# EasyEDA schematic SCH_Calculator YSWS_2026-07-11.json
TITLE: Sheet_1; REV: 1.0; Date: 2026-06-30; Sheet: 1/1; Drawn By: esemv; Company: Your Company
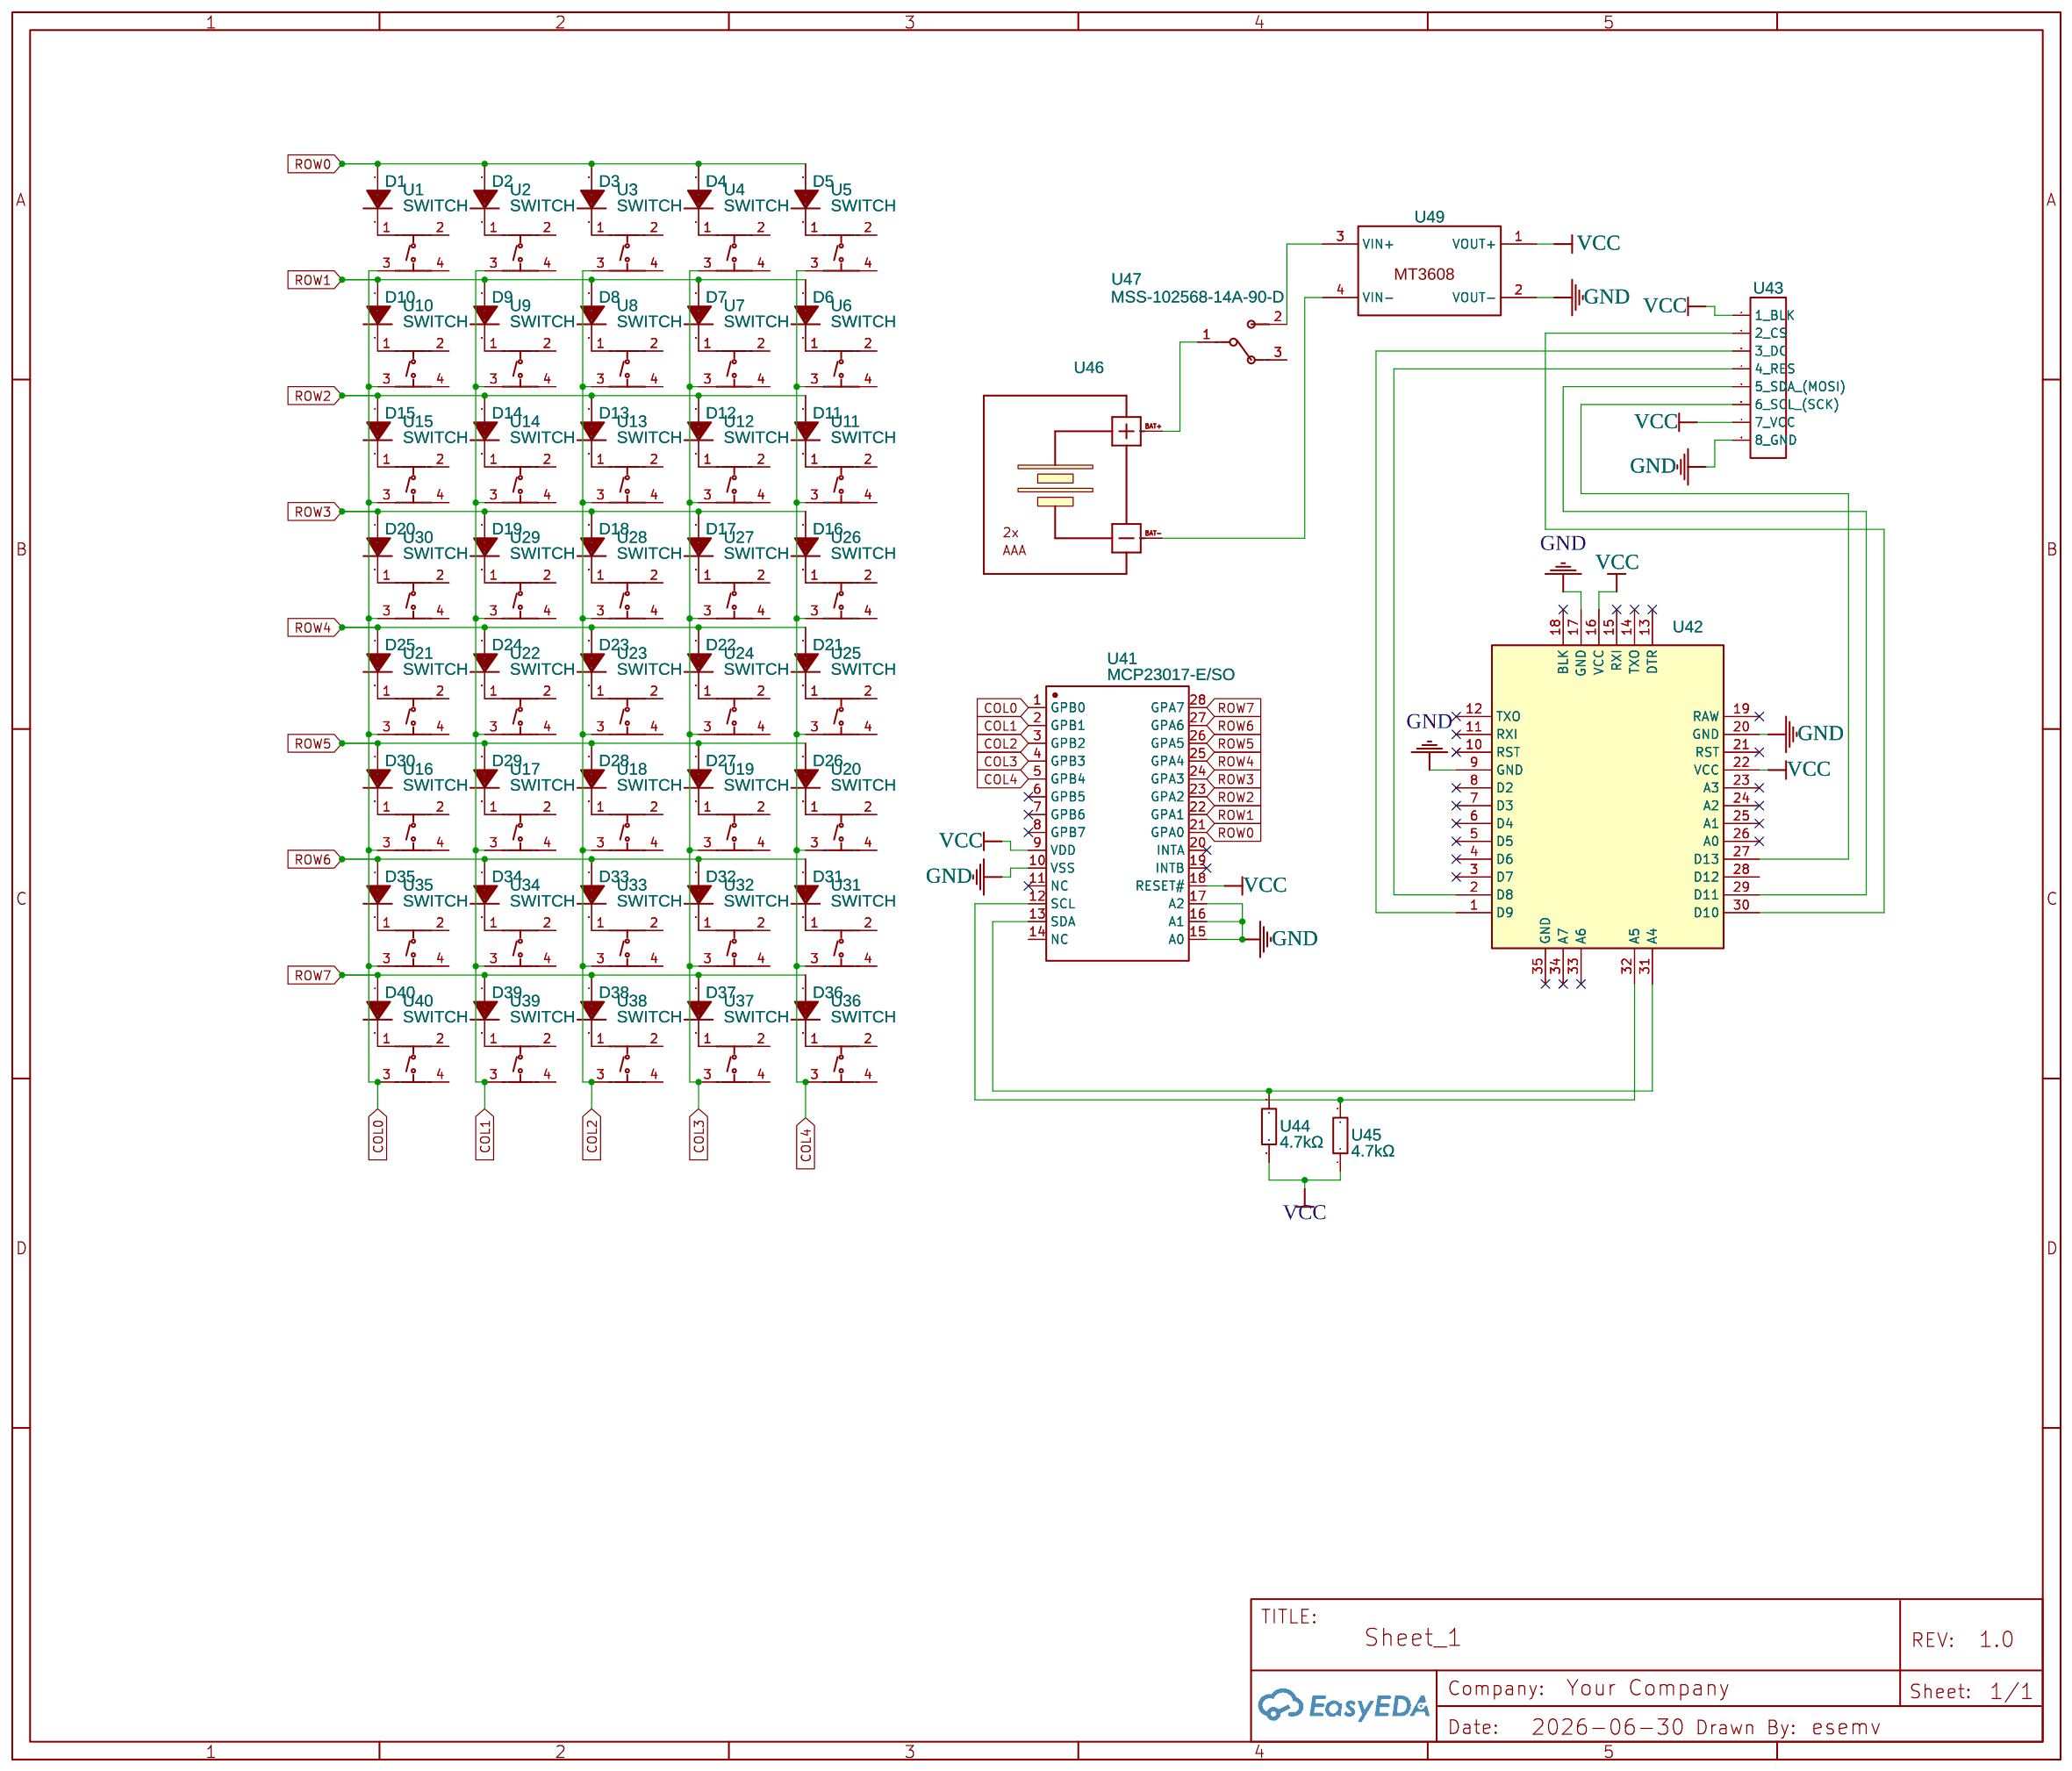
[diagram p0: schematic sheet]

## Parts
D1  1N4148  [DO-35_BD2.0-L4.0-P8.00-D0.5-FD]
D2  1N4148  [DO-35_BD2.0-L4.0-P8.00-D0.5-FD]
D3  1N4148  [DO-35_BD2.0-L4.0-P8.00-D0.5-FD]
D4  1N4148  [DO-35_BD2.0-L4.0-P8.00-D0.5-FD]
D5  1N4148  [DO-35_BD2.0-L4.0-P8.00-D0.5-FD]
D6  1N4148  [DO-35_BD2.0-L4.0-P8.00-D0.5-FD]
D7  1N4148  [DO-35_BD2.0-L4.0-P8.00-D0.5-FD]
D8  1N4148  [DO-35_BD2.0-L4.0-P8.00-D0.5-FD]
D9  1N4148  [DO-35_BD2.0-L4.0-P8.00-D0.5-FD]
D10  1N4148  [DO-35_BD2.0-L4.0-P8.00-D0.5-FD]
D11  1N4148  [DO-35_BD2.0-L4.0-P8.00-D0.5-FD]
D12  1N4148  [DO-35_BD2.0-L4.0-P8.00-D0.5-FD]
D13  1N4148  [DO-35_BD2.0-L4.0-P8.00-D0.5-FD]
D14  1N4148  [DO-35_BD2.0-L4.0-P8.00-D0.5-FD]
D15  1N4148  [DO-35_BD2.0-L4.0-P8.00-D0.5-FD]
D16  1N4148  [DO-35_BD2.0-L4.0-P8.00-D0.5-FD]
D17  1N4148  [DO-35_BD2.0-L4.0-P8.00-D0.5-FD]
D18  1N4148  [DO-35_BD2.0-L4.0-P8.00-D0.5-FD]
D19  1N4148  [DO-35_BD2.0-L4.0-P8.00-D0.5-FD]
D20  1N4148  [DO-35_BD2.0-L4.0-P8.00-D0.5-FD]
D21  1N4148  [DO-35_BD2.0-L4.0-P8.00-D0.5-FD]
D22  1N4148  [DO-35_BD2.0-L4.0-P8.00-D0.5-FD]
D23  1N4148  [DO-35_BD2.0-L4.0-P8.00-D0.5-FD]
D24  1N4148  [DO-35_BD2.0-L4.0-P8.00-D0.5-FD]
D25  1N4148  [DO-35_BD2.0-L4.0-P8.00-D0.5-FD]
D26  1N4148  [DO-35_BD2.0-L4.0-P8.00-D0.5-FD]
D27  1N4148  [DO-35_BD2.0-L4.0-P8.00-D0.5-FD]
D28  1N4148  [DO-35_BD2.0-L4.0-P8.00-D0.5-FD]
D29  1N4148  [DO-35_BD2.0-L4.0-P8.00-D0.5-FD]
D30  1N4148  [DO-35_BD2.0-L4.0-P8.00-D0.5-FD]
D31  1N4148  [DO-35_BD2.0-L4.0-P8.00-D0.5-FD]
D32  1N4148  [DO-35_BD2.0-L4.0-P8.00-D0.5-FD]
D33  1N4148  [DO-35_BD2.0-L4.0-P8.00-D0.5-FD]
D34  1N4148  [DO-35_BD2.0-L4.0-P8.00-D0.5-FD]
D35  1N4148  [DO-35_BD2.0-L4.0-P8.00-D0.5-FD]
D36  1N4148  [DO-35_BD2.0-L4.0-P8.00-D0.5-FD]
D37  1N4148  [DO-35_BD2.0-L4.0-P8.00-D0.5-FD]
D38  1N4148  [DO-35_BD2.0-L4.0-P8.00-D0.5-FD]
D39  1N4148  [DO-35_BD2.0-L4.0-P8.00-D0.5-FD]
D40  1N4148  [DO-35_BD2.0-L4.0-P8.00-D0.5-FD]
U1  SWITCH  [SW-TH_4P-L4.5-W4.5-P3.00-LS5.0-H5.5]
U2  SWITCH  [SW-TH_4P-L4.5-W4.5-P3.00-LS5.0-H5.5]
U3  SWITCH  [SW-TH_4P-L4.5-W4.5-P3.00-LS5.0-H5.5]
U4  SWITCH  [SW-TH_4P-L4.5-W4.5-P3.00-LS5.0-H5.5]
U5  SWITCH  [SW-TH_4P-L4.5-W4.5-P3.00-LS5.0-H5.5]
U6  SWITCH  [SW-TH_4P-L4.5-W4.5-P3.00-LS5.0-H5.5]
U7  SWITCH  [SW-TH_4P-L4.5-W4.5-P3.00-LS5.0-H5.5]
U8  SWITCH  [SW-TH_4P-L4.5-W4.5-P3.00-LS5.0-H5.5]
U9  SWITCH  [SW-TH_4P-L4.5-W4.5-P3.00-LS5.0-H5.5]
U10  SWITCH  [SW-TH_4P-L4.5-W4.5-P3.00-LS5.0-H5.5]
U11  SWITCH  [SW-TH_4P-L4.5-W4.5-P3.00-LS5.0-H5.5]
U12  SWITCH  [SW-TH_4P-L4.5-W4.5-P3.00-LS5.0-H5.5]
U13  SWITCH  [SW-TH_4P-L4.5-W4.5-P3.00-LS5.0-H5.5]
U14  SWITCH  [SW-TH_4P-L4.5-W4.5-P3.00-LS5.0-H5.5]
U15  SWITCH  [SW-TH_4P-L4.5-W4.5-P3.00-LS5.0-H5.5]
U16  SWITCH  [SW-TH_4P-L4.5-W4.5-P3.00-LS5.0-H5.5]
U17  SWITCH  [SW-TH_4P-L4.5-W4.5-P3.00-LS5.0-H5.5]
U18  SWITCH  [SW-TH_4P-L4.5-W4.5-P3.00-LS5.0-H5.5]
U19  SWITCH  [SW-TH_4P-L4.5-W4.5-P3.00-LS5.0-H5.5]
U20  SWITCH  [SW-TH_4P-L4.5-W4.5-P3.00-LS5.0-H5.5]
U21  SWITCH  [SW-TH_4P-L4.5-W4.5-P3.00-LS5.0-H5.5]
U22  SWITCH  [SW-TH_4P-L4.5-W4.5-P3.00-LS5.0-H5.5]
U23  SWITCH  [SW-TH_4P-L4.5-W4.5-P3.00-LS5.0-H5.5]
U24  SWITCH  [SW-TH_4P-L4.5-W4.5-P3.00-LS5.0-H5.5]
U25  SWITCH  [SW-TH_4P-L4.5-W4.5-P3.00-LS5.0-H5.5]
U26  SWITCH  [SW-TH_4P-L4.5-W4.5-P3.00-LS5.0-H5.5]
U27  SWITCH  [SW-TH_4P-L4.5-W4.5-P3.00-LS5.0-H5.5]
U28  SWITCH  [SW-TH_4P-L4.5-W4.5-P3.00-LS5.0-H5.5]
U29  SWITCH  [SW-TH_4P-L4.5-W4.5-P3.00-LS5.0-H5.5]
U30  SWITCH  [SW-TH_4P-L4.5-W4.5-P3.00-LS5.0-H5.5]
U31  SWITCH  [SW-TH_4P-L4.5-W4.5-P3.00-LS5.0-H5.5]
U32  SWITCH  [SW-TH_4P-L4.5-W4.5-P3.00-LS5.0-H5.5]
U33  SWITCH  [SW-TH_4P-L4.5-W4.5-P3.00-LS5.0-H5.5]
U34  SWITCH  [SW-TH_4P-L4.5-W4.5-P3.00-LS5.0-H5.5]
U35  SWITCH  [SW-TH_4P-L4.5-W4.5-P3.00-LS5.0-H5.5]
U36  SWITCH  [SW-TH_4P-L4.5-W4.5-P3.00-LS5.0-H5.5]
U37  SWITCH  [SW-TH_4P-L4.5-W4.5-P3.00-LS5.0-H5.5]
U38  SWITCH  [SW-TH_4P-L4.5-W4.5-P3.00-LS5.0-H5.5]
U39  SWITCH  [SW-TH_4P-L4.5-W4.5-P3.00-LS5.0-H5.5]
U40  SWITCH  [SW-TH_4P-L4.5-W4.5-P3.00-LS5.0-H5.5]
U41  MCP23017-E/SO  [SOIC-28_L18.0-W7.5-P1.27-LS10.3-BL]
U42  NO  [ARDUINO PRO MINI SMD]
U43  NO  [HDR-M-2.54_1X8]
U44  4.7kΩ  [RES-TH_BD2.7-L6.2-P10.20-D0.4]
U45  4.7kΩ  [RES-TH_BD2.7-L6.2-P10.20-D0.4]
U46  NO  [BATTERY-HOLDER-2AAA]
U47  MSS-102568-14A-90-D  [SW-TH_CUI_MSS-102568-14A-90-D]
U49  NO  [MT3608 MODULE]

## Library data of the parts
D1-D40 = 1N4148: Supplier: LCSC; Manufacturer: ST(先科); Supplier Part: C14516; JLCPCB Part Class: Extended Part; link: https://lcsc.com/eda_search?q=C14516&%26type=1&ref=editor
U1-U40 = ZX-QC1212-7.0CJ: Supplier: LCSC; Supplier Part: C7470189; Manufacturer: Megastar(兆星); Contributor: lcsc; JLCPCB Part Class: Extended Part; link: https://lcsc.com/eda_search?q=C7470189&%26type=1&ref=editor
U41 = MCP23017-E/SO: Contributor: LCSC; Supplier: LCSC; Manufacturer: MICROCHIP(美国微芯); Supplier Part: C47023; JLCPCB Part Class: Extended Part; link: https://lcsc.com/eda_search?q=C47023&%26type=1&ref=editor
U42 = ARDUINO PRO MINI - 3.3V: sourceId: 1T5FDZYC8; Contributor: Steve Yant
U43 = HDR-M-2.54_1x8: Supplier Part: C190820; Supplier: LCSC; Contributor: alaminkabir.eee18
U44 U45 = CR1/4W-4K7±5%-OT26: Contributor: LCSC; Supplier: LCSC; Supplier Part: C2896831; Manufacturer: VO(翔胜); JLCPCB Part Class: Extended Part; link: https://lcsc.com/eda_search?q=C2896831&%26type=1&ref=editor
U46 = BATTERY-HOLDER-2AAA: Contributor: Krzysztof
U47 = MSS-102568-14A-90-D: Contributor: lcsc; Supplier: LCSC; Supplier Part: C3664511; Manufacturer: CUI; JLCPCB Part Class: Extended Part; link: https://lcsc.com/eda_search?q=C3664511&%26type=1&ref=editor
U49 = MT3608 module: Contributor: niwciu

## Nets
GND: U41.10(VSS) U41.15(A0) U41.16(A1) U41.17(A2) U42.9(GND) U42.17(GND) U42.20(GND) U43.8(8 GND) U49.2(VOUT-)
VCC: U41.9(VDD) U41.18(RESET#) U42.16(VCC) U42.22(VCC) U43.1(1 BLK) U43.7(7 VCC) U44.1 U45.1 U49.1(VOUT+)
COL0: U1.3 U10.3 U15.3 U16.3 U21.3 U30.3 U35.3 U40.3 U41.1(GPB0)
COL1: U2.3 U9.3 U14.3 U17.3 U22.3 U29.3 U34.3 U39.3 U41.2(GPB1)
COL2: U3.3 U8.3 U13.3 U18.3 U23.3 U28.3 U33.3 U38.3 U41.3(GPB2)
COL3: U4.3 U7.3 U12.3 U19.3 U24.3 U27.3 U32.3 U37.3 U41.4(GPB3)
COL4: U5.3 U6.3 U11.3 U20.3 U25.3 U26.3 U31.3 U36.3 U41.5(GPB4)
ROW0: D1.1(A) D2.1(A) D3.1(A) D4.1(A) D5.1(A) U41.21(GPA0)
ROW1: D6.1(A) D7.1(A) D8.1(A) D9.1(A) D10.1(A) U41.22(GPA1)
ROW2: D11.1(A) D12.1(A) D13.1(A) D14.1(A) D15.1(A) U41.23(GPA2)
ROW3: D16.1(A) D17.1(A) D18.1(A) D19.1(A) D20.1(A) U41.24(GPA3)
ROW4: D21.1(A) D22.1(A) D23.1(A) D24.1(A) D25.1(A) U41.25(GPA4)
ROW5: D26.1(A) D27.1(A) D28.1(A) D29.1(A) D30.1(A) U41.26(GPA5)
ROW6: D31.1(A) D32.1(A) D33.1(A) D34.1(A) D35.1(A) U41.27(GPA6)
ROW7: D36.1(A) D37.1(A) D38.1(A) D39.1(A) D40.1(A) U41.28(GPA7)
Net-(D1-2): D1.2(C) U1.1
Net-(D2-2): D2.2(C) U2.1
Net-(D3-2): D3.2(C) U3.1
Net-(D4-2): D4.2(C) U4.1
Net-(D5-2): D5.2(C) U5.1
Net-(D6-2): D6.2(C) U6.1
Net-(D7-2): D7.2(C) U7.1
Net-(D8-2): D8.2(C) U8.1
Net-(D9-2): D9.2(C) U9.1
Net-(D10-2): D10.2(C) U10.1
Net-(D11-2): D11.2(C) U11.1
Net-(D12-2): D12.2(C) U12.1
Net-(D13-2): D13.2(C) U13.1
Net-(D14-2): D14.2(C) U14.1
Net-(D15-2): D15.2(C) U15.1
Net-(D16-2): D16.2(C) U26.1
Net-(D17-2): D17.2(C) U27.1
Net-(D18-2): D18.2(C) U28.1
Net-(D19-2): D19.2(C) U29.1
Net-(D20-2): D20.2(C) U30.1
Net-(D21-2): D21.2(C) U25.1
Net-(D22-2): D22.2(C) U24.1
Net-(D23-2): D23.2(C) U23.1
Net-(D24-2): D24.2(C) U22.1
Net-(D25-2): D25.2(C) U21.1
Net-(D26-2): D26.2(C) U20.1
Net-(D27-2): D27.2(C) U19.1
Net-(D28-2): D28.2(C) U18.1
Net-(D29-2): D29.2(C) U17.1
Net-(D30-2): D30.2(C) U16.1
Net-(D31-2): D31.2(C) U31.1
Net-(D32-2): D32.2(C) U32.1
Net-(D33-2): D33.2(C) U33.1
Net-(D34-2): D34.2(C) U34.1
Net-(D35-2): D35.2(C) U35.1
Net-(D36-2): D36.2(C) U36.1
Net-(D37-2): D37.2(C) U37.1
Net-(D38-2): D38.2(C) U38.1
Net-(D39-2): D39.2(C) U39.1
Net-(D40-2): D40.2(C) U40.1
Net-(U41-12): U41.12(SCL) U42.32(A5) U45.2
Net-(U41-13): U41.13(SDA) U42.31(A4) U44.2
Net-(U42-1): U42.1(D9) U43.3(3 DC)
Net-(U42-2): U42.2(D8) U43.4(4 RES)
Net-(U42-27): U42.27(D13) U43.6(6 SCL (SCK))
Net-(U42-29): U42.29(D11) U43.5(5 SDA (MOSI))
Net-(U42-30): U42.30(D10) U43.2(2 CS)
Net-(U46-BAT+): U46.BAT+ U47.1
Net-(U46-BAT-): U46.BAT- U49.4(VIN-)
Net-(U47-2): U47.2 U49.3(VIN+)

Not connected (* = marked no-connect by the designer): U1 2 4; U2 2 4; U3 2 4; U4 2 4; U5 2 4; U6 2 4; U7 2 4; U8 2 4; U9 2 4; U10 2 4; U11 2 4; U12 2 4; U13 2 4; U14 2 4; U15 2 4; U16 2 4; U17 2 4; U18 2 4; U19 2 4; U20 2 4; U21 2 4; U22 2 4; U23 2 4; U24 2 4; U25 2 4; U26 2 4; U27 2 4; U28 2 4; U29 2 4; U30 2 4; U31 2 4; U32 2 4; U33 2 4; U34 2 4; U35 2 4; U36 2 4; U37 2 4; U38 2 4; U39 2 4; U40 2 4; U41 6(GPB5)* 7(GPB6)* 8(GPB7)* 11(NC)* 14(NC) 19(INTB)* 20(INTA)*; U42 3(D7)* 4(D6)* 5(D5)* 6(D4)* 7(D3)* 8(D2)* 10(RST)* 11(RXI)* 12(TXO)* 13(DTR)* 14(TXO)* 15(RXI)* 18(BLK)* 19(RAW)* 21(RST)* 23(A3)* 24(A2)* 25(A1)* 26(A0)* 28(D12) 33(A6)* 34(A7)* 35(GND)*; U47 3
